# Altium schematic sheet Schematic.SchDoc: Metal Detector
size A; Author: Boris Cherkasskiy; DrawnBy: Boris Cherkasskiy; Engineer: Boris Cherkasskiy; Address1: Boris Cherkasskiy; DocumentNumber: 1; Revision: 2; SheetNumber: 1; SheetTotal: 1; ProjectName: Metal Detector
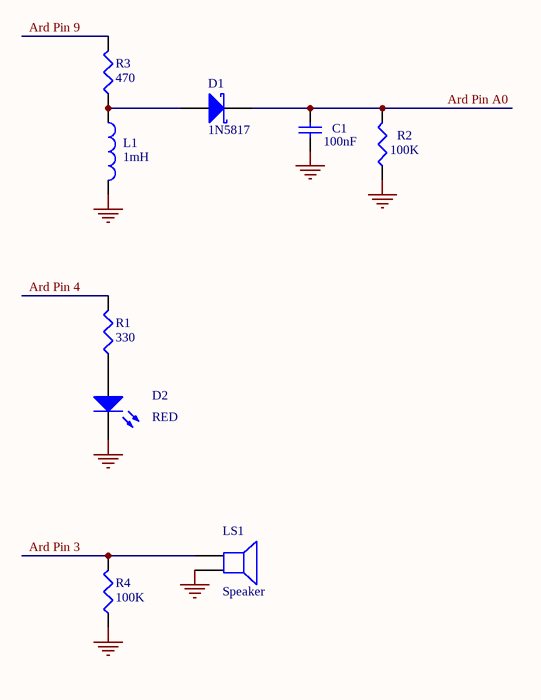
[diagram p0: Schematic.SchDoc]

## Parts
C1  100nF
D1  1N5817
D2  RED
L1  1mH
LS1  Speaker
R1  330
R2  100K
R3  470
R4  100K

## Nets
GND: C1.1 D2.2(K) L1.2 LS1.2 R2.1 R4.1
Ard Pin 3: LS1.1 R4.2
Ard Pin 4: R1.2
Ard Pin 9: R3.2
Ard Pin A0: C1.2 D1.2(K) R2.2
NetD1_1: D1.1(A) L1.1 R3.1
NetD2_1: D2.1(A) R1.1

## Notes on the sheet
- Title
- Size:
- Date:
- A
- Number:
- Time:
- Revision:
- Sheet
- of
- File:

## Library data of the parts
C1 = Cap: Capacitor
D1 = D Schottky: Schottky Diode
D2 = LED0: Red LED
L1 = Inductor
LS1 = Speaker: Piezo speaker
R1-R4 = Res3: Resistor